# EasyEDA Pro project ProPrj_Shady Pad_2026-03-07.epro

# Board Shady Pad
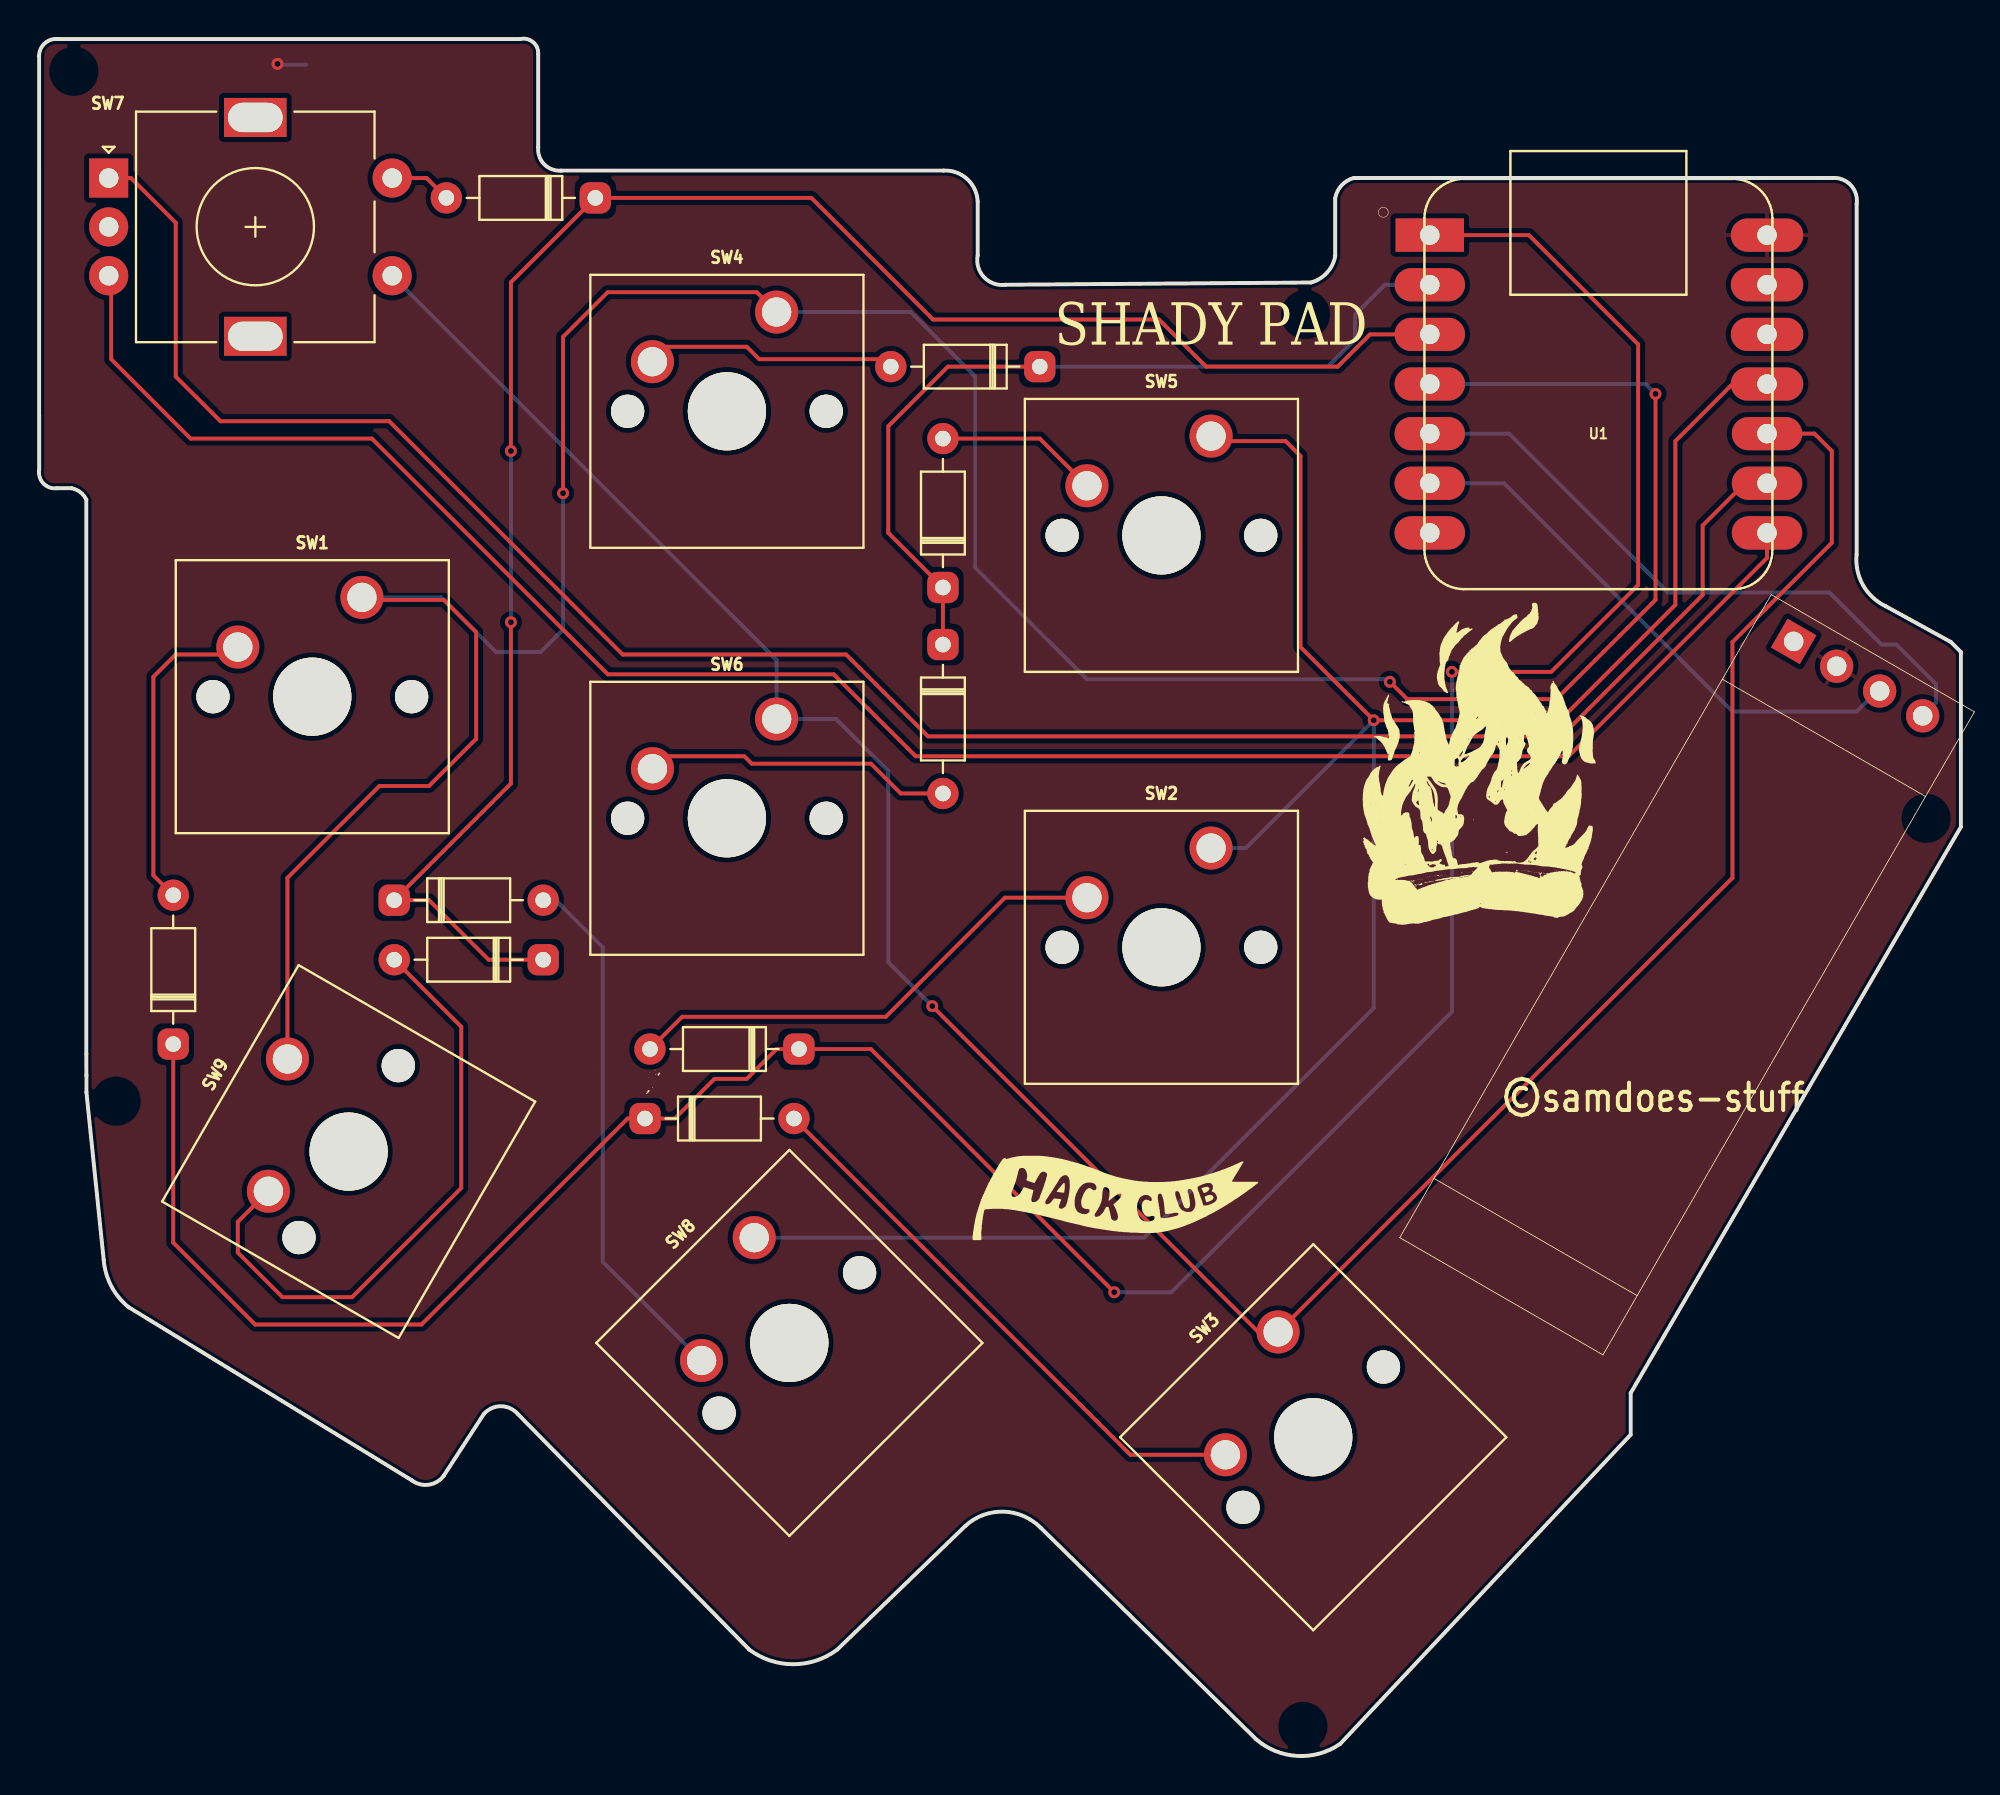
[diagram p0: board, top side]
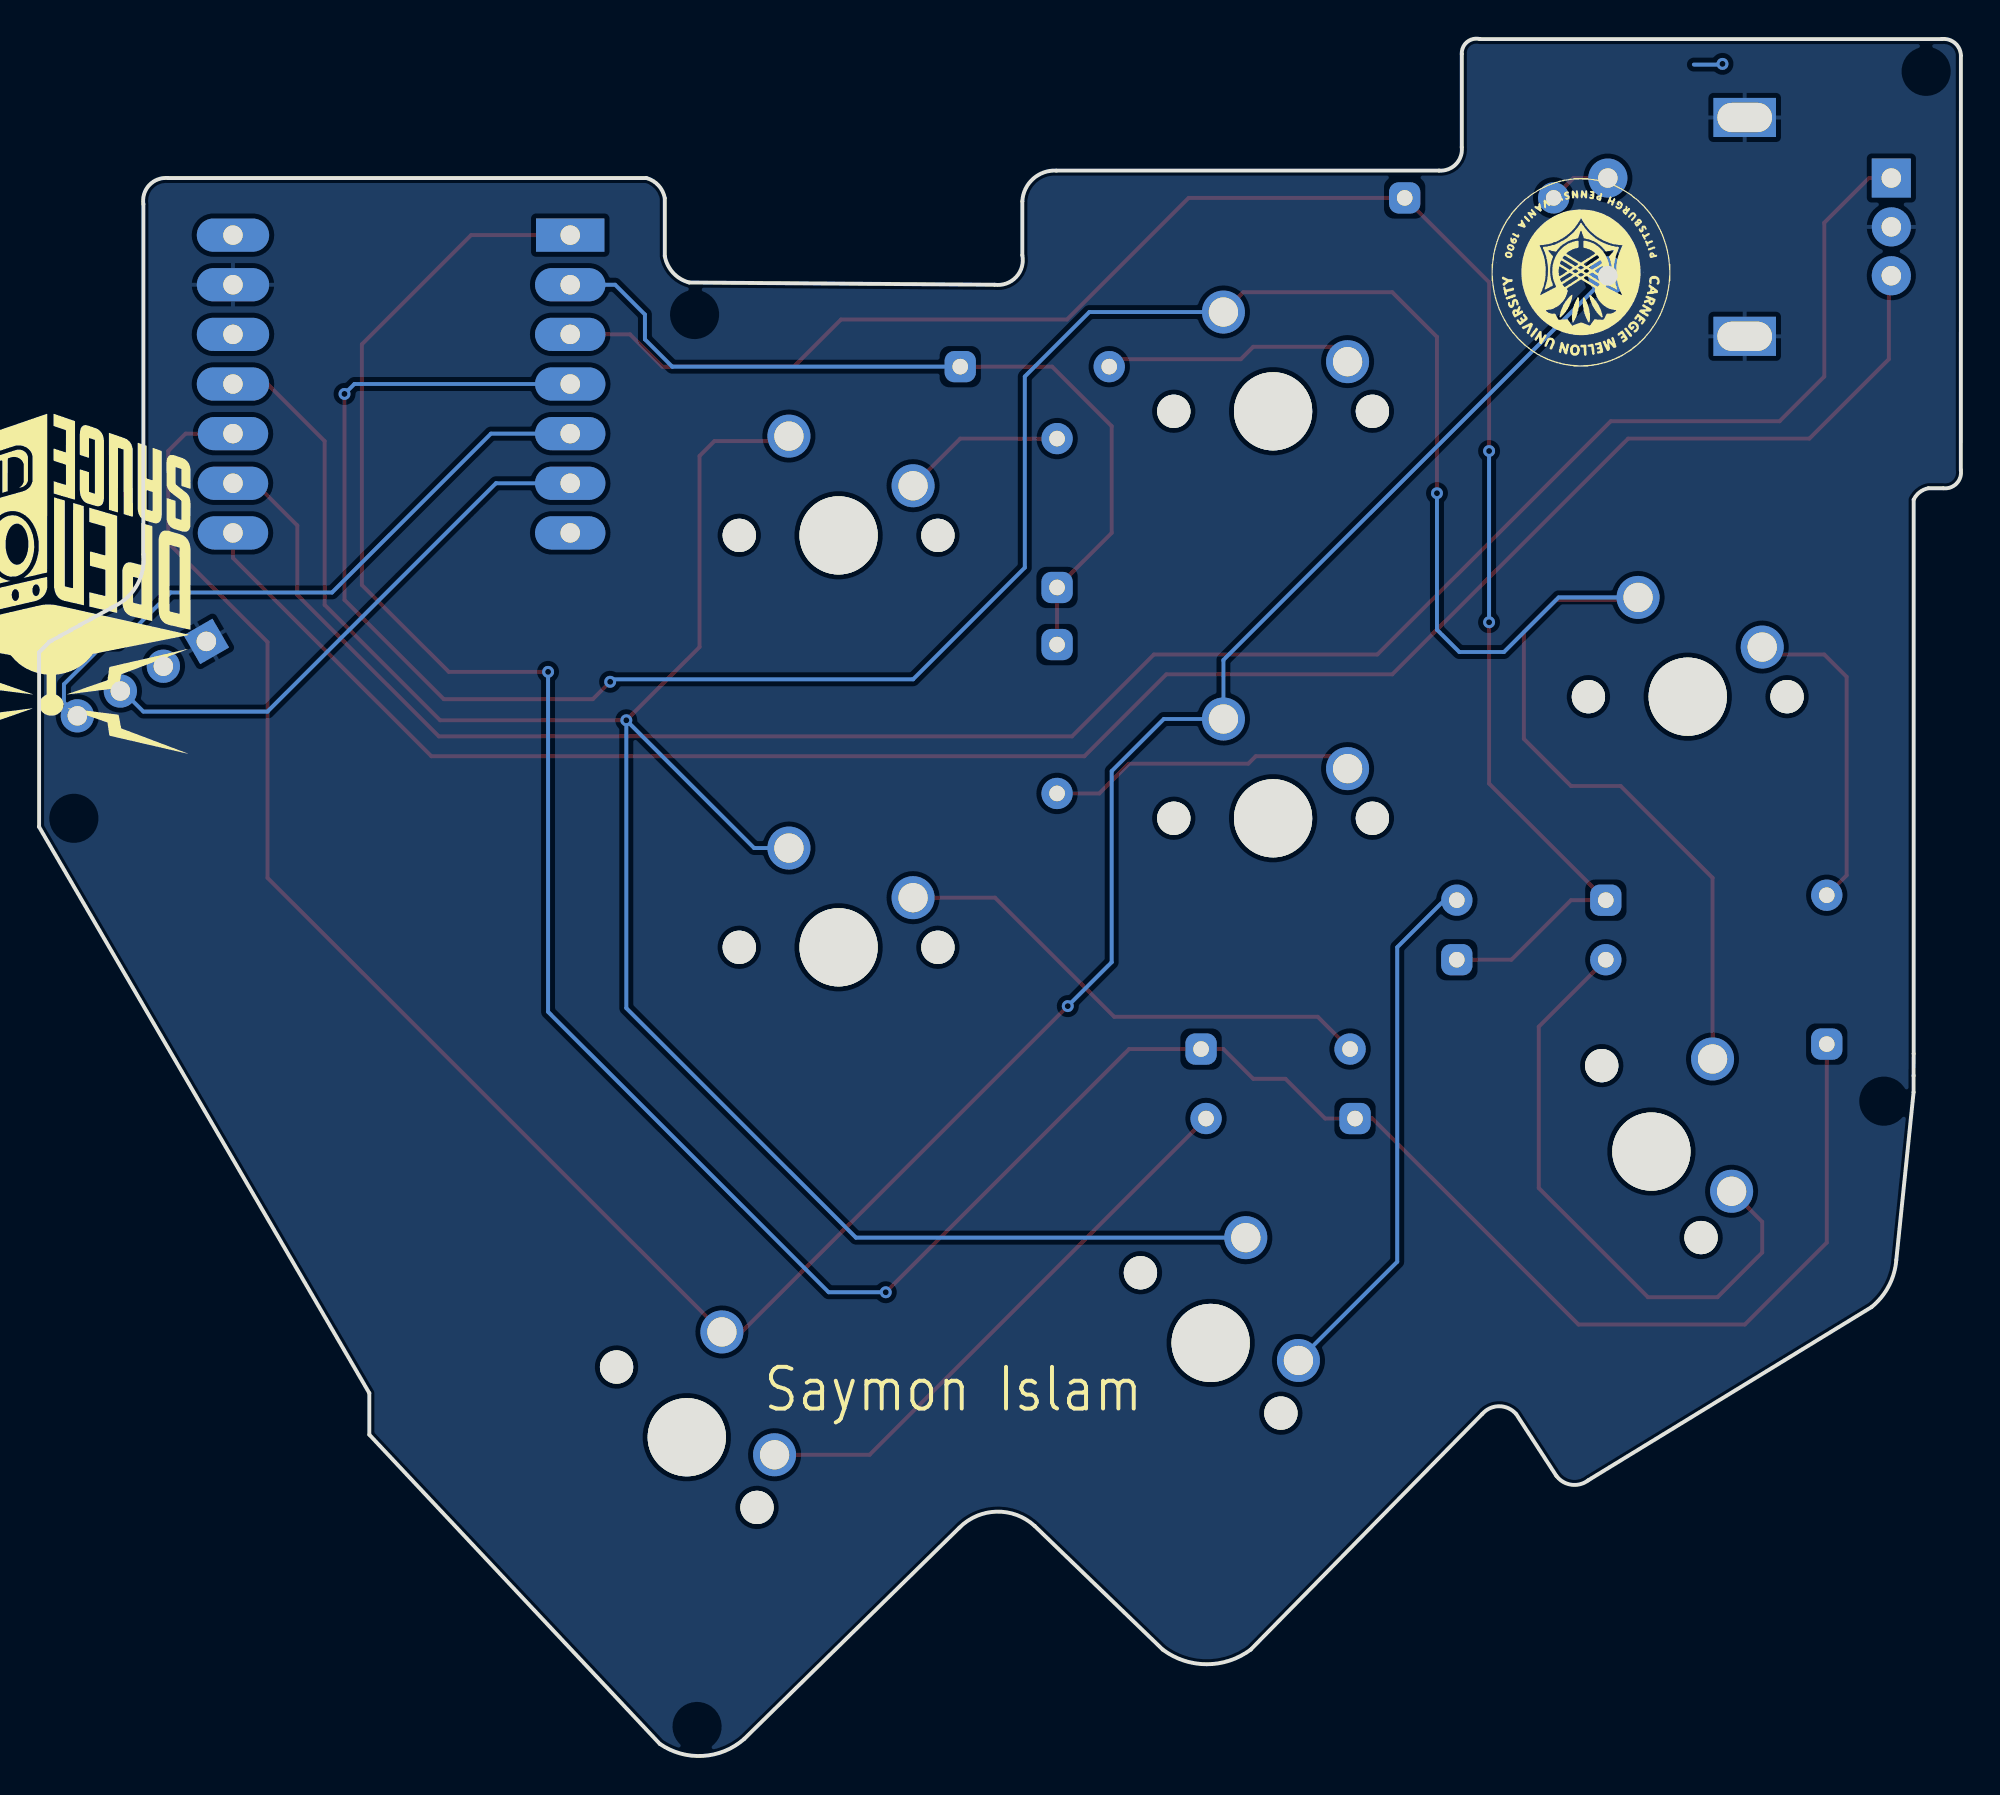
[diagram p1: board, bottom side, seen from below]

Outline 98.3 x 87.87 mm; copper layers: Top Layer, Bottom Layer. Coordinates in mm from the lower left corner of the outline.
Outline path: 0,87.01 arc(0.3,87.66) 0.97,87.87 24.61,87.87 arc(25.26,87.71) 25.53,87.1 25.53,82.33 arc(25.84,81.46) 26.7,81.13 46.27,81.13 arc(47.47,80.71) 48.01,79.56 48.01,76.8 arc(48.33,75.68) 49.43,75.29 65.05,75.41 arc(65.87,75.9) 66.3,76.76 66.3,79.72 arc(66.62,80.37) 67.23,80.75 91.7,80.75 arc(92.66,80.39) 92.97,79.42 92.97,61.49 arc(93.29,59.93) 94.45,58.84 97.79,57 98.3,56.5 98.3,47.55 81.41,18.57 81.41,16.44 66.55,0.62 arc(64.35,0) 62.23,0.87 51.23,11.68 arc(49.32,12.5) 47.38,11.77 40.83,5.44 arc(38.58,4.69) 36.32,5.44 24.48,17.5 arc(23.61,17.9) 22.75,17.49 20.69,14.33 arc(19.93,13.88) 19.07,14.1 4.58,22.97 arc(3.69,24.04) 3.3,25.38 2.42,33.97 2.42,34.81 2.42,35.94 2.42,64.29 arc(2.11,64.68) 1.66,64.88 0.9,64.88 arc(0.22,65.12) 0,65.81 0,87.01
Stack: Top Layer 0.035mm / Dielectric1 1.51mm FR4 er 4.5 / Bottom Layer 0.035mm

## Design rules (mm)
spacing safeClearance (default): track to track 0.152, other pairs 0.152 to 0.3
track width trackWidth (default): min 0.127, default 0.254, max 2.54
differential pair differentialPair (default): width min 0.127, default 0.254, max 2.54; gap min 0.152, default 0.152
via viaSize (default): diameter min 0.5, default 0.61, max 10; hole min 0.3, default 0.305, max 6

## Placement (name value [footprint] x y rotation side)
D9  1N4148  [Diode_THT:D_DO-35_SOD27_P7.62mm_Horizontal]  6.86 36.43 90 top
D10  1N4148  [Diode_THT:D_DO-35_SOD27_P7.62mm_Horizontal]  51.18 71.1 180 top
D11  1N4148  [Diode_THT:D_DO-35_SOD27_P7.62mm_Horizontal]  25.78 40.75 180 top
D12  1N4148  [Diode_THT:D_DO-35_SOD27_P7.62mm_Horizontal]  38.87 36.18 180 top
D13  1N4148  [Diode_THT:D_DO-35_SOD27_P7.62mm_Horizontal]  46.23 59.8 90 top
D14  1N4148  [Diode_THT:D_DO-35_SOD27_P7.62mm_Horizontal]  18.16 43.8 0 top
D15  1N4148  [Diode_THT:D_DO-35_SOD27_P7.62mm_Horizontal]  30.99 32.62 0 top
D16  1N4148  [Diode_THT:D_DO-35_SOD27_P7.62mm_Horizontal]  46.23 56.88 270 top
D17  1N4148  [Diode_THT:D_DO-35_SOD27_P7.62mm_Horizontal]  28.45 79.74 180 top
J2  Conn_01x04_Pin  [Library:SSD1306-0.91-OLED-4pin-128x32]  69.6 26.52 60 top
SW1  SW_Push  [Button_Switch_Keyboard:SW_Cherry_MX_1.00u_PCB]  16.51 59.29 0 top
SW2  SW_Push  [Button_Switch_Keyboard:SW_Cherry_MX_1.00u_PCB]  59.95 46.46 0 top
SW3  SW_Push  [Button_Switch_Keyboard:SW_Cherry_MX_1.00u_PCB]  63.38 21.7 45 top
SW4  SW_Push  [Button_Switch_Keyboard:SW_Cherry_MX_1.00u_PCB]  37.72 73.9 0 top
SW5  SW_Push  [Button_Switch_Keyboard:SW_Cherry_MX_1.00u_PCB]  59.95 67.55 0 top
SW6  SW_Push  [Button_Switch_Keyboard:SW_Cherry_MX_1.00u_PCB]  37.72 53.07 0 top
SW7  RotaryEncoder_Switch  [Rotary_Encoder:RotaryEncoder_Alps_EC11E-Switch_Vertical_H20mm]  3.56 80.75 0 top
SW8  SW_Push  [Button_Switch_Keyboard:SW_Cherry_MX_1.00u_PCB]  36.58 26.52 45 top
SW9  SW_Push  [Button_Switch_Keyboard:SW_Cherry_MX_1.00u_PCB]  12.7 35.67 60 top
U1  MOUDLE-SEEEDUINO-XIAO  [Library:XIAO-Generic-Hybrid-14P-2.54-21X17.8MM]  79.76 70.21 0 top

## Footprints (pads in the part's own frame, mm; a bottom-side part is the same pattern mirrored in y, then rotated)
Button_Switch_Keyboard:SW_Cherry_MX_1.00u_PCB
  round 1.7 hole 1.7: (-7.62,-5.08) (2.54,-5.08)
  round 4 hole 4: (-2.54,-5.08)
  round 2.2 hole 1.5: 1(0,0) 2(-6.35,-2.54)
Diode_THT:D_DO-35_SOD27_P7.62mm_Horizontal
  rrect 1.6x1.6 hole 0.8: 1(0,0)
  round 1.6 hole 0.8: 2(7.62,0)
Library:SSD1306-0.91-OLED-4pin-128x32
  rect 1.7x1.7 hole 1: 1(36.5,-2.19)
  round 1.7 hole 1: 2(36.5,-4.73) 3(36.5,-7.27) 4(36.5,-9.81)
Library:XIAO-Generic-Hybrid-14P-2.54-21X17.8MM
  rect 3.5x1.7 hole 1: 1(-8.625,7.62)
  oval 3.6x1.7 hole 1: 2(-8.625,5.08) 3(-8.625,2.54) 4(-8.625,0) 5(-8.625,-2.54) 6(-8.625,-5.08) 7(-8.625,-7.62) 8(8.625,-7.62) 9(8.625,-5.08) 10(8.625,-2.54)
  oval 3.7x1.7 hole 1: 11(8.625,0) 12(8.625,2.54) 13(8.625,5.08) 14(8.625,7.62)
Rotary_Encoder:RotaryEncoder_Alps_EC11E-Switch_Vertical_H20mm
  rect 2x2 hole 1: A(0,0)
  round 2 hole 1: B(0,-5) C(0,-2.5) S1(14.5,-5) S2(14.5,0)
  rect 3.2x2 hole 2.8x1.5: MP(7.5,3.1) MP(7.5,-8.1)

## Nets
3V3: U1.12
GND: J2.1 SW7.C SW7.MP U1.13
VCC: J2.2 U1.14
C0: SW1.1 SW4.1 SW9.1 U1.4
C1: SW2.1 SW5.1 SW8.1 U1.11
C2: SW3.1 SW6.1 SW7.S1 U1.10
EC11A: SW7.A U1.9
EC11B: SW7.B U1.8
EC11SWA: D17.2 SW7.S2
LED: U1.7
NET-(D9-A): D9.2 SW1.2
NET-(D10-A): D10.2 SW4.2
NET-(D11-A): D11.2 SW9.2
NET-(D12-A): D12.2 SW2.2
NET-(D13-A): D13.2 SW5.2
NET-(D14-A): D14.2 SW8.2
NET-(D15-A): D15.2 SW3.2
NET-(D16-A): D16.2 SW6.2
R0: D9.1 D12.1 D15.1 U1.1
R1: D10.1 D13.1 D16.1 U1.2
R2: D11.1 D14.1 D17.1 U1.3
SCL: J2.3 U1.6
SDA: J2.4 U1.5

## Via types
v1: diameter 0.61, hole 0.305, Top Layer to Bottom Layer, 10 vias

## Routing (per net, layer and track width the routed paths; a pad name or vN(x,y) marks a point on that pad's centre or on a via; arc(x,y) is an arc through that point)
VCC: length 1.5
  Bottom Layer w0.2: v1(12.19,86.6) 12.23,86.56 13.66,86.56
C0: length 156.4
  Top Layer w0.2: v1(82.68,69.7) 82.68,59.16 77.6,54.08 69.98,54.08 v1(69.09,54.97) ; SW9.1 12.7,44.94 17.4,49.64 19.94,49.64 22.36,52.05 22.36,57.51 20.7,59.16 16.64,59.16 SW1.1 ; v1(26.8,64.62) 26.8,72.63 29.09,74.91 36.71,74.91 SW4.1
  Bottom Layer w0.2: SW1.1 20.58,59.29 23.37,56.5 25.66,56.5 26.8,57.64 v1(26.8,64.62) ; v1(69.09,54.97) 68.96,55.1 53.6,55.1 47.88,60.81 47.88,70.59 44.58,73.9 SW4.1 ; v1(82.68,69.7) 82.17,70.21 U1.4
C1: length 114.5
  Top Layer w0.2: SW5.1 60.2,67.29 63.76,67.29 64.52,66.53 64.52,56.75 v1(68.27,53) 77.79,53 83.7,58.91 83.7,67.29 86.62,70.21 U1.11
  Bottom Layer w0.2: SW8.1 56.52,26.52 68.27,38.27 v1(68.27,53) 61.72,46.46 SW2.1
C2: length 135.7
  Top Layer w0.2: v1(45.68,38.37) 62.36,21.7 SW3.1 86.62,44.94 86.62,57 91.7,62.08 91.7,66.78 90.81,67.67 U1.10
  Bottom Layer w0.2: v1(45.68,38.37) 43.44,40.62 43.44,50.4 40.77,53.07 SW6.1 37.72,56.09 SW7.S1
EC11A: length 108.7
  Top Layer w0.2: U1.9 87.25,65.13 85.09,62.97 85.09,59.42 77.85,52.18 45.47,52.18 41.28,56.37 29.85,56.37 17.91,68.31 9.27,68.31 6.99,70.59 6.99,78.47 4.7,80.75 SW7.A
EC11B: length 102.9
  Top Layer w0.2: U1.8 88.38,61.31 78.23,51.16 44.83,51.16 40.64,55.35 29.09,55.35 17.02,67.42 7.75,67.42 3.69,71.48 3.69,75.63 SW7.B
EC11SWA: length 3.2
  Top Layer w0.2: SW7.S2 19.81,80.75 D17.2
NET-(D9-A): length 16.5
  Top Layer w0.2: SW1.2 9.78,56.37 6.99,56.37 5.84,55.23 5.84,45.07 D9.2
NET-(D10-A): length 12.9
  Top Layer w0.2: D10.2 43.18,71.48 36.83,71.48 36.2,72.12 32.13,72.12 31.37,71.36
NET-(D11-A): length 31.6
  Top Layer w0.2: SW9.2 10.16,27.33 10.16,25.76 12.45,23.48 16,23.48 21.59,29.06 21.59,37.32 18.16,40.75
NET-(D12-A): length 25.6
  Top Layer w0.2: D12.2 32.9,37.83 43.31,37.83 49.41,43.92 SW2.2
NET-(D13-A): length 8.4
  Top Layer w0.2: D13.2 51.18,67.42 SW5.2
NET-(D14-A): length 27.3
  Bottom Layer w0.2: D14.2 26.42,43.8 28.83,41.38 28.83,25.29 SW8.2
NET-(D15-A): length 29.2
  Top Layer w0.2: D15.2 55.82,15.41 SW3.2
NET-(D16-A): length 15.9
  Top Layer w0.2: 31.37,50.53 32.01,51.16 36.07,51.16 36.45,50.78 42.55,50.78 44.07,49.26 46.23,49.26
R0: length 148.3
  Top Layer w0.2: v1(54.99,23.73) 42.55,36.18 D12.1 37.72,36.18 36.2,34.65 34.55,34.65 32.51,32.62 D15.1 30.1,32.62 19.56,22.08 11.05,22.08 6.86,26.27 D9.1 ; U1.1 76.2,77.83 81.79,72.24 81.79,59.93 77.35,55.48 v1(72.27,55.48)
  Bottom Layer w0.2: v1(72.27,55.48) 72.27,38.08 57.91,23.73 v1(54.99,23.73)
R1: length 43.8
  Top Layer w0.2: D16.1 D13.1 43.44,62.59 43.44,68.05 46.48,71.1 D10.1
  Bottom Layer w0.2: U1.2 68.84,75.29 67.31,73.77 67.31,72.5 65.92,71.1 D10.1
R2: length 96
  Top Layer w0.2: v1(24.13,66.78) 24.13,75.42 D17.1 39.5,79.74 45.72,73.51 57.28,73.51 59.69,71.1 66.42,71.1 68.07,72.75 U1.3 ; D11.1 22.99,40.75 19.94,43.8 D14.1 24.13,49.77 v1(24.13,58.02)
  Bottom Layer w0.2: v1(24.13,58.02) v1(24.13,66.78)
SCL: length 28.3
  Bottom Layer w0.2: U1.6 74.93,65.13 86.62,53.45 92.97,53.45 94.02,54.5 J2.3
SDA: length 33.1
  Bottom Layer w0.2: 96.34,53.23 97.03,53.92 97.03,54.85 95,56.88 94.24,56.88 91.57,59.54 83.31,59.54 75.19,67.67 U1.5

## Copper pours and planes (outline as drawn; the poured copper is in the pictures)
GND on Bottom Layer: -11.3,98.79 105.29,98.79 105.29,-6.5 -11.3,-6.5
VCC on Top Layer: -7.74,99.68 106.18,99.68 106.18,-3.83 -7.74,-3.83

## Text on the board
Bottom Silkscreen Layer: Saymon Islam
Top Silkscreen Layer: ©️samdoes-stuff | SHADY PAD
